# EAGLE design 4 multiple seven sigment (EAGLE 6.1)
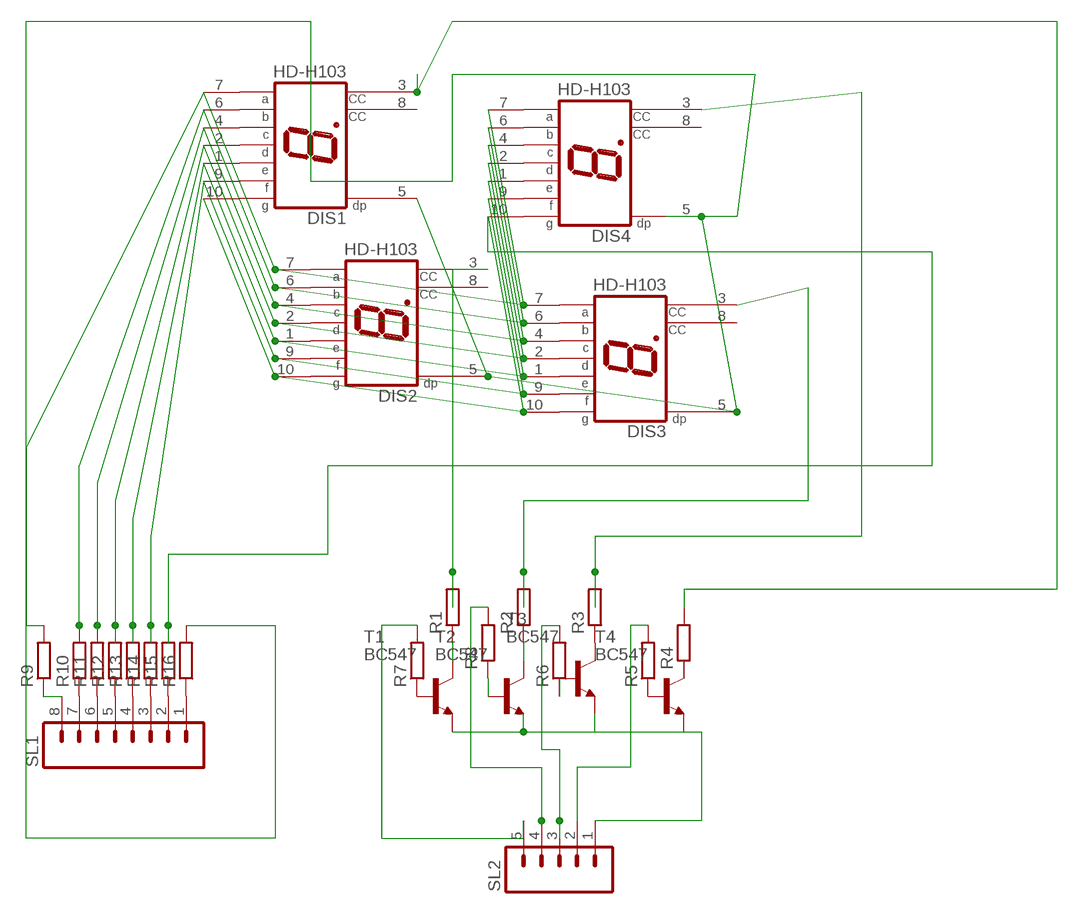
[diagram p0: schematic, sheet 1]

## Parts
DIS1  HD-H103  [HDSP-M]
DIS2  HD-H103  [HDSP-M]
DIS3  HD-H103  [HDSP-M]
DIS4  HD-H103  [HDSP-M]
R1  R-EU_0204/7  [0204/7]
R2  R-EU_0204/7  [0204/7]
R3  R-EU_0204/7  [0204/7]
R4  R-EU_0204/7  [0204/7]
R5  R-EU_0204/7  [0204/7]
R6  R-EU_0204/7  [0204/7]
R7  R-EU_0204/7  [0204/7]
R8  R-EU_0204/7  [0204/7]
R9  R-EU_0204/7  [0204/7]
R10  R-EU_0204/7  [0204/7]
R11  R-EU_0204/7  [0204/7]
R12  R-EU_0204/7  [0204/7]
R13  R-EU_0204/7  [0204/7]
R14  R-EU_0204/7  [0204/7]
R15  R-EU_0204/7  [0204/7]
R16  R-EU_0204/7  [0204/7]
SL1  M08  [08P]
SL2  M05  [05P]
T1  BC547  [TO92]
T2  BC547  [TO92]
T3  BC547  [TO92]
T4  BC547  [TO92]

## Nets
N$1: R8.2 SL2.4
N$2: DIS1.9(F) DIS2.9(F) DIS3.9(F) DIS4.9(F) R14.2
N$3: DIS1.2(D) DIS2.2(D) DIS3.2(D) DIS4.2(D) R12.2
N$4: DIS1.6(B) DIS2.6(B) DIS3.6(B) DIS4.6(B) R10.2
N$5: DIS1.7(A) DIS2.7(A) DIS3.7(A) DIS4.7(A) R9.2
N$6: DIS3.3(CC) R2.2
N$7: DIS1.4(C) DIS2.4(C) DIS3.4(C) DIS4.4(C) R11.2
N$8: DIS1.1(E) DIS2.1(E) DIS3.1(E) DIS4.1(E) R13.2
N$9: R6.2 SL2.3
N$10: DIS3.8(CC)
N$11: R1.1 T1.3(C)
N$12: R2.1 T2.3(C)
N$13: R3.1 T3.3(C)
N$14: R4.1 T4.3(C)
N$15: R5.1 T4.2(B)
N$16: R6.1 T3.2(B)
N$17: R7.1 T1.2(B)
N$18: R8.1 T2.2(B)
N$19: R9.1 SL1.8
N$20: R10.1 SL1.7
N$21: R11.1 SL1.6
N$22: R13.1 SL1.4
N$23: R14.1 SL1.3
N$24: R15.1 SL1.2
N$25: R16.1 SL1.1
N$26: R12.1 SL1.5
N$27: DIS1.10(G) DIS2.10(G) DIS3.10(G) DIS4.10(G) R15.2
N$28: DIS1.5(DP) DIS2.5(DP) DIS3.5(DP) DIS4.5(DP) R16.2
N$29: R7.2 SL2.5
N$30: R5.2 SL2.2
N$31: SL2.1 T1.1(E) T2.1(E) T3.1(E) T4.1(E)
N$32: DIS1.3(CC) R4.2
N$33: DIS4.3(CC) R3.2
N$34: DIS2.3(CC) R1.2
Unconnected: DIS1.8(CC) DIS2.8(CC) DIS4.8(CC)

## Library data of the parts
DIS1-DIS4 = display-hp:HD-H103: LED DISPLAY 1-character 7 segment, decimal point right; OC_FARNELL: unknown; OC_NEWARK: unknown
R1-R16 = rcl:R-EU_: RESISTOR, European symbol
SL1 = con-amp-quick:M08: AMP QUICK CONNECTOR; OC_FARNELL: unknown; OC_NEWARK: unknown
SL2 = con-amp-quick:M05: AMP QUICK CONNECTOR; OC_FARNELL: unknown; OC_NEWARK: unknown
T1-T4 = transistor:BC547: NPN TRANSISTOR

## Board
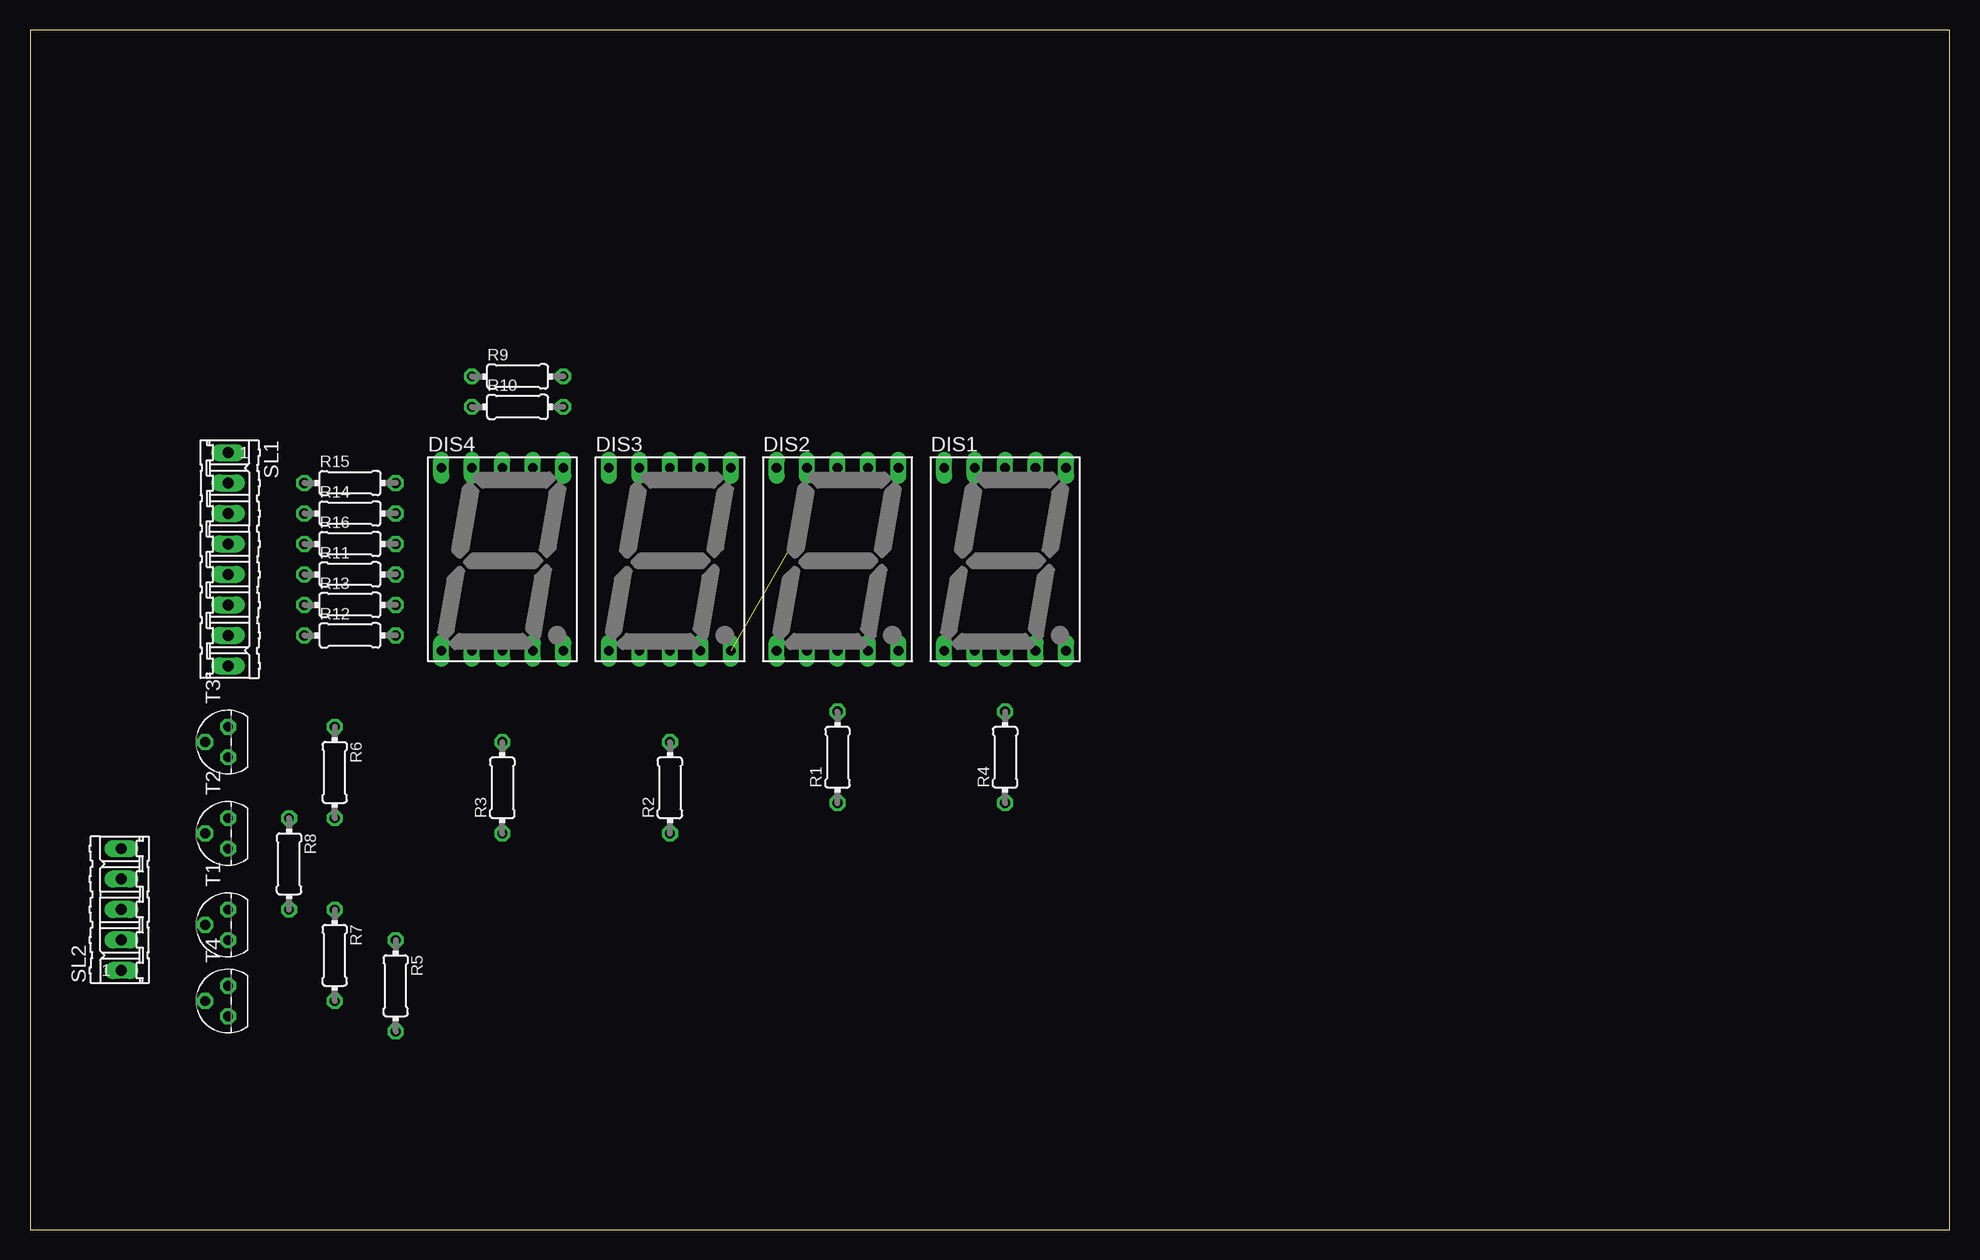
[diagram p1: board, top side]
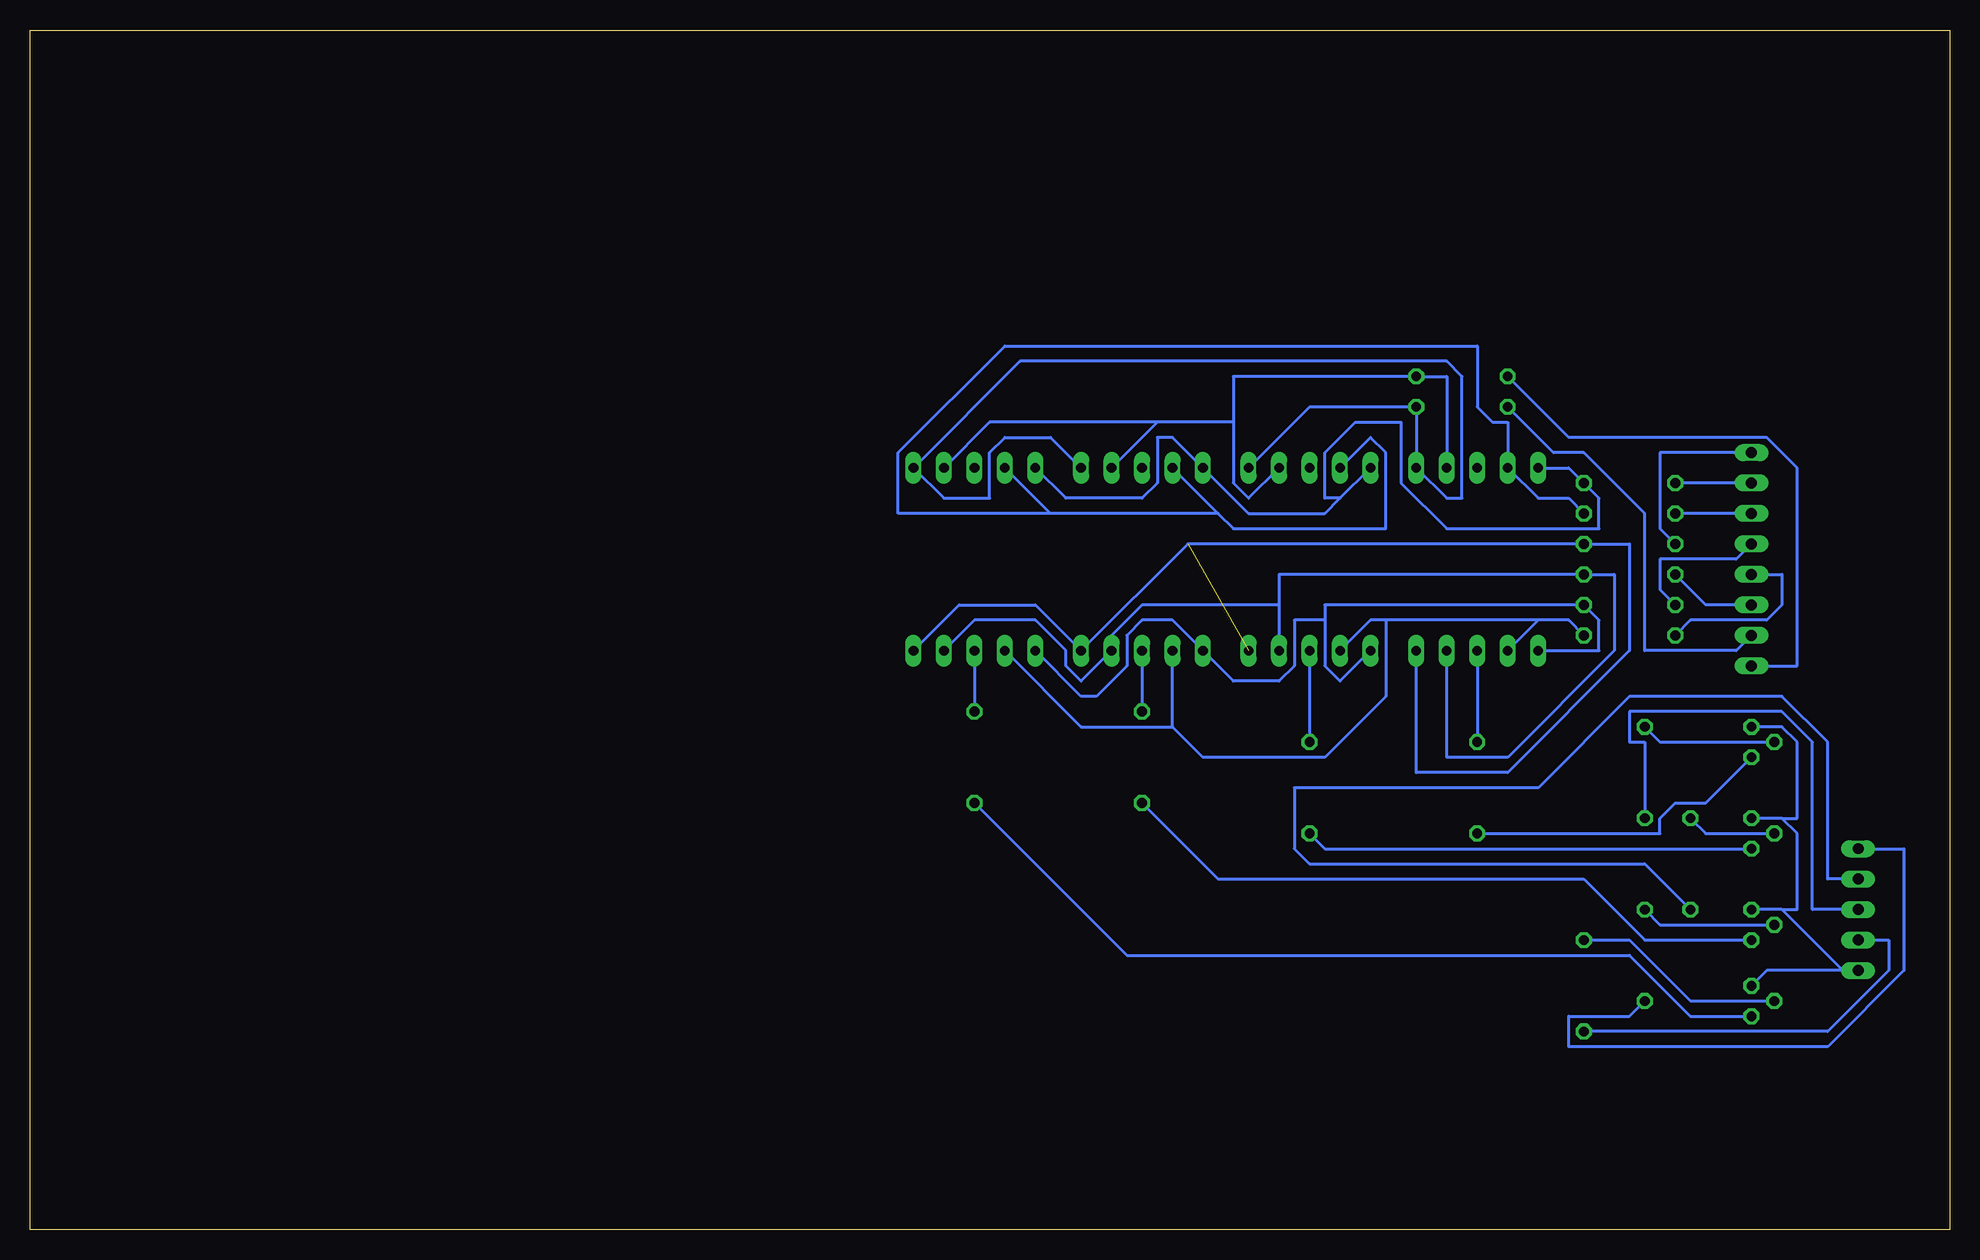
[diagram p2: board, bottom side, seen from below]

Size 160 x 100 mm. Coordinates in mm from the lower left corner, seen from the top.
Outline: 0,0 160,0 160,100 0,100 0,0
Copper layers (1*16): Top 0.035mm / dielectric 1.5mm / Bottom 0.035mm
Design rules: minimum track width 10mil, minimum drill 24mil, track to track 8mil, track to pad 8mil, pad to pad 8mil, via to via 8mil, smd to smd 8mil, copper to edge 40mil, drill to drill 8mil, minimum pad ring 10mil, minimum via ring 8mil, stop-mask expansion 4mil, vias tented up to drill 0mil, thermal gap 10mil

### Footprints (pad centres in the part's own frame; a part is rotated, then mirrored left to right if it is on the bottom)
HDSP-M = drill 0.813 long: 1 -5.08,-7.62; 2 -2.54,-7.62; 3 0,-7.62; 4 2.54,-7.62; 5 5.08,-7.62; 6 5.08,7.62; 7 2.54,7.62; 8 0,7.62; 9 -2.54,7.62; 10 -5.08,7.62
0204/7 = drill 0.813 octagon: 1 -3.81,0; 2 3.81,0
08P = drill 0.914 long: 1 -8.89,0; 2 -6.35,0; 3 -3.81,0; 4 -1.27,0; 5 1.27,0; 6 3.81,0; 7 6.35,0; 8 8.89,0
05P = drill 0.914 long: 1 -5.08,0; 2 -2.54,0; 3 0,0; 4 2.54,0; 5 5.08,0
TO92 = drill 0.813 octagon: 1 1.27,0; 2 0,1.905; 3 -1.27,0

### Placement (x,y rotation side)
DIS1  81.28,55.88 0 top
DIS2  67.31,55.88 0 top
DIS3  53.34,55.88 0 top
DIS4  39.37,55.88 0 top
R1  67.31,39.37 90 top
R2  53.34,36.83 90 top
R3  39.37,36.83 90 top
R4  81.28,39.37 90 top
R5  30.48,20.32 270 top
R6  25.4,38.1 270 top
R7  25.4,22.86 270 top
R8  21.59,30.48 270 top
R9  40.64,71.12 0 top
R10  40.64,68.58 0 top
R11  26.67,54.61 0 top
R12  26.67,49.53 0 top
R13  26.67,52.07 0 top
R14  26.67,59.69 0 top
R15  26.67,62.23 0 top
R16  26.67,57.15 0 top
SL1  16.51,55.88 270 top
SL2  7.62,26.67 90 top
T1  16.51,25.4 90 top
T2  16.51,33.02 90 top
T3  16.51,40.64 90 top
T4  16.51,19.05 90 top

### Tracks (layer width: path | path; a pad name or v marks a point on that pad's centre or on a via)
N$1
  Bottom 0.254: R8.2 25.4,30.48 53.34,30.48 54.61,31.75 54.61,36.83 34.29,36.83 26.67,44.45 13.97,44.45 10.16,40.64 10.16,29.21 SL2.4
N$2
  Bottom 0.254: R14.2 31.75,60.96 34.29,60.96 DIS4.9 36.83,67.31 38.1,67.31 39.37,68.58 39.37,73.66 78.74,73.66 87.63,64.77 87.63,59.69 74.93,59.69 | DIS3.9 48.26,66.04 46.99,64.77 46.99,58.42 59.69,58.42 60.96,59.69 | DIS2.9 60.96,59.69 | 74.93,59.69 DIS1.9 | 60.96,59.69 74.93,59.69
N$3
  Bottom 0.254: 64.77,41.91 DIS2.2 | 64.77,41.91 72.39,41.91 DIS1.2 | 34.29,50.8 DIS4.2 | 34.29,50.8 31.75,50.8 R12.2 | DIS3.2 48.26,50.8 46.99,50.8 | 34.29,50.8 46.99,50.8 | 64.77,41.91 62.23,39.37 52.07,39.37 46.99,44.45 46.99,50.8
N$4
  Bottom 0.254: DIS2.6 74.93,66.04 78.74,66.04 80.01,64.77 80.01,60.96 83.82,60.96 DIS1.6 77.47,72.39 41.91,72.39 40.64,71.12 40.64,60.96 41.91,60.96 DIS4.6 R10.2 53.34,68.58 DIS3.6
N$5
  Bottom 0.254: DIS4.7 41.91,71.12 R9.2 59.69,71.12 59.69,67.31 | DIS3.7 58.42,60.96 59.69,62.23 59.69,67.31 | 66.04,67.31 DIS2.7 | 59.69,67.31 66.04,67.31 | DIS1.7 80.01,67.31 66.04,67.31
N$6
  Bottom 0.254: DIS3.3 R2.2
N$7
  Bottom 0.254: DIS4.4 41.91,39.37 36.83,39.37 27.94,48.26 27.94,54.61 R11.2 55.88,54.61 55.88,52.07 | 55.88,52.07 DIS3.4 | 55.88,52.07 67.31,52.07 69.85,49.53 DIS2.4 72.39,45.72 73.66,46.99 73.66,48.26 76.2,50.8 81.28,50.8 DIS1.4
N$8
  Bottom 0.254: DIS4.1 29.21,48.26 29.21,50.8 R13.2 52.07,52.07 52.07,50.8 | DIS3.1 50.8,45.72 52.07,46.99 52.07,50.8 | 52.07,50.8 54.61,50.8 54.61,46.99 55.88,45.72 59.69,45.72 DIS2.1 64.77,50.8 67.31,50.8 68.58,49.53 68.58,46.99 71.12,44.45 72.39,44.45 DIS1.1
N$9
  Bottom 0.254: R6.2 25.4,40.64 26.67,40.64 26.67,43.18 13.97,43.18 11.43,40.64 11.43,26.67 SL2.3
N$11
  Bottom 0.254: T1.3 25.4,24.13 30.48,29.21 60.96,29.21 R1.1
N$12
  Bottom 0.254: T2.3 52.07,31.75 R2.1
N$13
  Bottom 0.254: T3.3 20.32,35.56 22.86,35.56 24.13,34.29 24.13,33.02 R3.1
N$14
  Bottom 0.254: T4.3 21.59,17.78 26.67,22.86 68.58,22.86 R4.1
N$15
  Bottom 0.254: T4.2 21.59,19.05 26.67,24.13 R5.1
N$16
  Bottom 0.254: T3.2 24.13,40.64 R6.1
N$17
  Bottom 0.254: T1.2 24.13,25.4 R7.1
N$18
  Bottom 0.254: T2.2 20.32,33.02 R8.1
N$19
  Bottom 0.254: R9.1 31.75,66.04 15.24,66.04 12.7,63.5 12.7,46.99 SL1.8
N$20
  Bottom 0.254: R10.1 33.02,64.77 30.48,64.77 25.4,59.69 25.4,48.26 17.78,48.26 SL1.7
N$21
  Bottom 0.254: R11.1 20.32,52.07 SL1.6
N$22
  Bottom 0.254: R13.1 24.13,53.34 24.13,55.88 17.78,55.88 SL1.4
N$23
  Bottom 0.254: SL1.3 R14.1
N$24
  Bottom 0.254: SL1.2 R15.1
N$25
  Bottom 0.254: R16.1 24.13,58.42 24.13,64.77 SL1.1
N$26
  Bottom 0.254: R12.1 21.59,50.8 15.24,50.8 13.97,52.07 13.97,54.61 SL1.5
N$27
  Bottom 0.254: DIS4.10 31.75,63.5 R15.2 29.21,60.96 29.21,58.42 41.91,58.42 45.72,62.23 45.72,67.31 49.53,67.31 52.07,64.77 52.07,60.96 50.8,60.96 | 50.8,60.96 52.07,59.69 58.42,59.69 DIS2.10 64.77,66.04 66.04,66.04 66.04,62.23 67.31,60.96 73.66,60.96 DIS1.10 | 50.8,60.96 DIS3.10
N$28  (1 unrouted)
  Bottom 0.254: DIS1.5 82.55,52.07 76.2,52.07 DIS2.5 63.5,57.15 R16.2 26.67,57.15 26.67,48.26 36.83,38.1 44.45,38.1 DIS4.5
N$29
  Bottom 0.254: R7.2 26.67,17.78 31.75,17.78 31.75,15.24 10.16,15.24 3.81,21.59 3.81,31.75 SL2.5
N$30
  Bottom 0.254: R5.2 10.16,16.51 5.08,21.59 5.08,24.13 SL2.2
N$31
  Bottom 0.254: T4.1 15.24,21.59 8.89,21.59 | 13.97,26.67 T1.1 | 8.89,21.59 13.97,26.67 | 8.89,21.59 SL2.1 | 13.97,34.29 T2.1 | 13.97,34.29 12.7,33.02 12.7,26.67 13.97,26.67 | T3.1 13.97,41.91 12.7,40.64 12.7,34.29 13.97,34.29
N$32
  Bottom 0.254: DIS1.3 R4.2
N$33
  Bottom 0.254: DIS4.3 R3.2
N$34
  Bottom 0.254: DIS2.3 R1.2